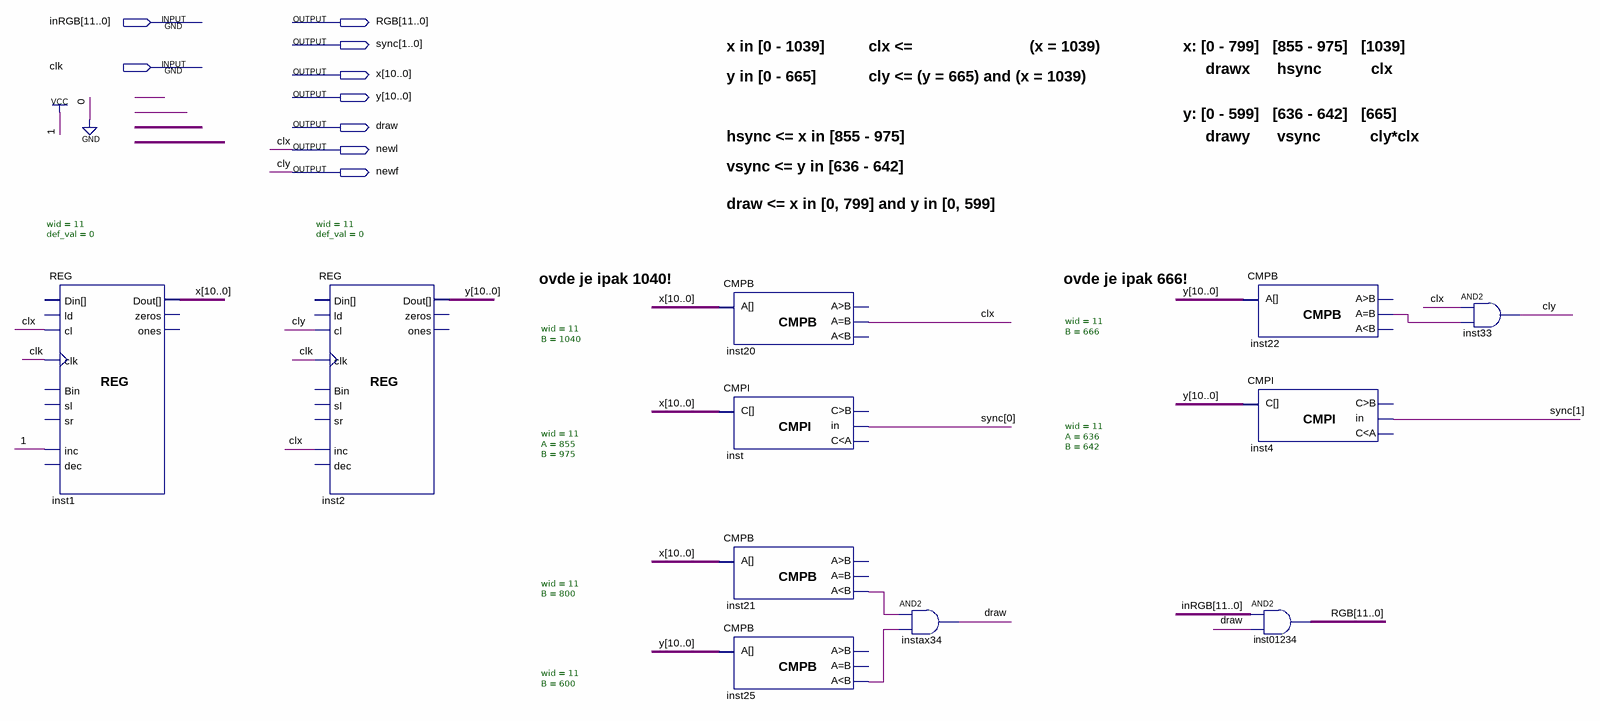
[diagram p0: schematic sheet]
// Quartus schematic DISPLAY.bdf as structural Verilog: 11 symbols, 9 pins
module DISPLAY (
  input  [11:0] inRGB,
  input  clk,
  output [11:0] RGB,
  output [1:0] sync,
  output [10:0] x,
  output [10:0] y,
  output draw,
  output newl,
  output newf
);

  wire inst21_ls, inst22_eq, inst25_ls;

  REG #(.wid(11), .def_val(0)) inst1 (
    .cl(newl), .clk(clk), .inc(1'b1), .Dout(x));  // open: ld, Bin, sl, sr, dec, Din, zeros, ones
  REG #(.wid(11), .def_val(0)) inst2 (
    .cl(newf), .clk(clk), .inc(newl), .Dout(y));  // open: ld, Bin, sl, sr, dec, Din, zeros, ones
  CMPB #(.wid(11), .B(1040)) inst20 (.A(x), .eq(newl));  // open: gr, ls
  CMPI #(.wid(11), .A(855), .B(975)) inst (.C(x), .isin(sync[0]));  // open: gr, ls
  CMPB #(.wid(11), .B(800)) inst21 (.A(x), .ls(inst21_ls));  // open: gr, eq
  CMPB #(.wid(11), .B(600)) inst25 (.A(y), .ls(inst25_ls));  // open: gr, eq
  and instax34 (draw, inst21_ls, inst25_ls);
  CMPB #(.wid(11), .B(666)) inst22 (.A(y), .eq(inst22_eq));  // open: gr, ls
  CMPI #(.wid(11), .A(636), .B(642)) inst4 (.C(y), .isin(sync[1]));  // open: gr, ls
  assign RGB = inRGB & {12{draw}};  // AND2 inst01234, 12 bits wide
  and inst33 (newf, newl, inst22_eq);

  // Other names for the same wires on the sheet: clx = newl; cly = newf

  // Notes on the sheet:
  //   x in [0 - 1039]
  //   clx <=                          (x = 1039)
  //   x: [0 - 799]   [855 - 975]   [1039]
  //        drawx      hsync           clx
  //   y in [0 - 665]
  //   cly <= (y = 665) and (x = 1039)
  //   y: [0 - 599]   [636 - 642]   [665]
  //   hsync <= x in [855 - 975]
  //        drawy      vsync           cly*clx
  //   vsync <= y in [636 - 642]
  //   draw <= x in [0, 799] and y in [0, 599]
  //   ovde je ipak 1040!
  //   ovde je ipak 666!
endmodule
